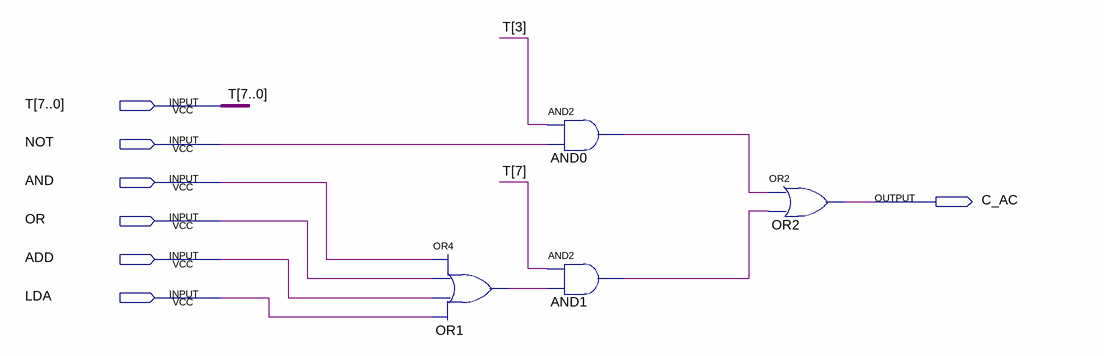
[diagram p0: schematic sheet]
// Quartus schematic C_AC.bdf as structural Verilog: 4 symbols, 7 pins
module C_AC (
  input  [7:0] T,
  input  NOT,
  input  AND,
  input  OR,
  input  ADD,
  input  LDA,
  output C_AC
);

  wire AND0_out, AND1_out, OR1_out;

  or OR1 (OR1_out, AND, OR, ADD, LDA);
  and AND0 (AND0_out, T[3], NOT);
  and AND1 (AND1_out, T[7], OR1_out);
  or OR2 (C_AC, AND0_out, AND1_out);
endmodule
